# Altium project SiLPA_HE.PrjPCB (part 1 of 7)
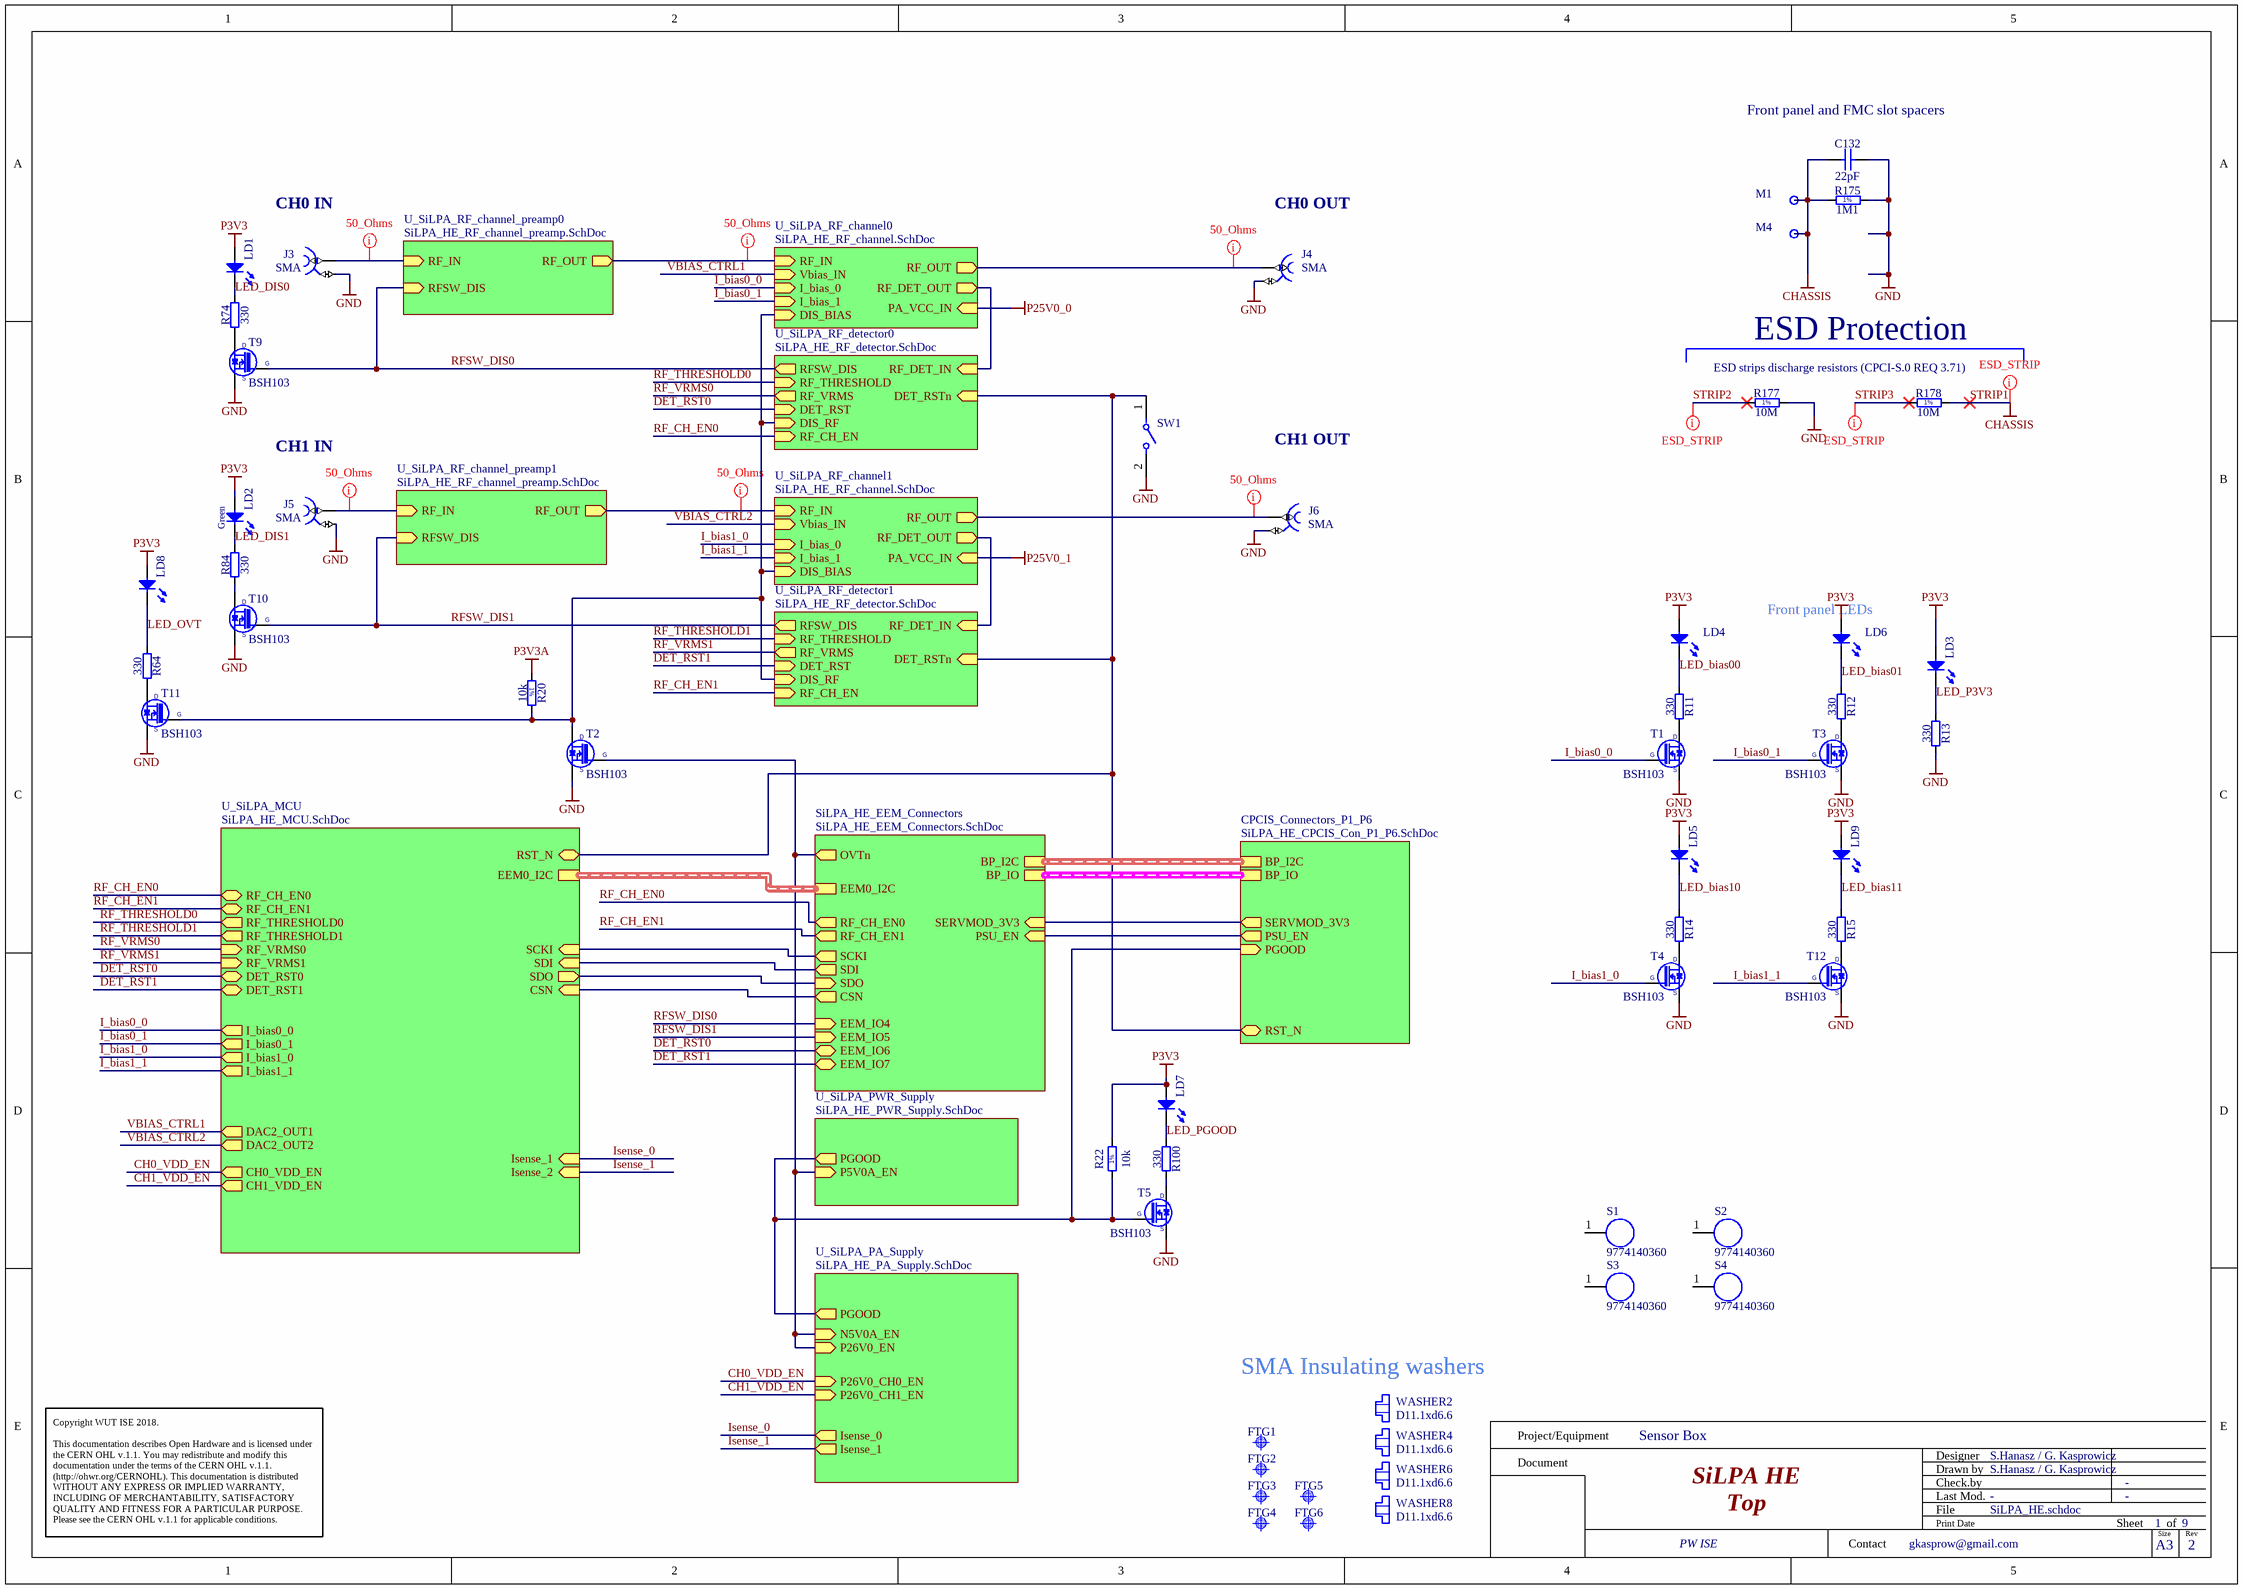
[diagram p0: SiLPA_HE.schdoc]
9 sheets, 662 parts. Net scope: hierarchical (ports join the sheet entries above them; power ports are global).
Board files: SiLPA_HE.PcbDoc, Panel_SiLPA.PcbDoc
Sheets:
  SiLPA_HE.schdoc
    SiLPA_HE_EEM_Connectors = SiLPA_HE_EEM_Connectors.SchDoc
    U_SiLPA_PWR_Supply = SiLPA_HE_PWR_Supply.SchDoc
    U_SiLPA_RF_channel0 = SiLPA_HE_RF_channel.SchDoc
    U_SiLPA_RF_channel_preamp0 = SiLPA_HE_RF_channel_preamp.SchDoc
    U_SiLPA_RF_detector0 = SiLPA_HE_RF_detector.SchDoc
    U_SiLPA_RF_channel_preamp1 = SiLPA_HE_RF_channel_preamp.SchDoc
    U_SiLPA_RF_detector1 = SiLPA_HE_RF_detector.SchDoc
    U_SiLPA_RF_channel1 = SiLPA_HE_RF_channel.SchDoc
    U_SiLPA_MCU = SiLPA_HE_MCU.SchDoc
    CPCIS_Connectors_P1_P6 = SiLPA_HE_CPCIS_Con_P1_P6.SchDoc
    U_SiLPA_PA_Supply = SiLPA_HE_PA_Supply.SchDoc

## Sheet SiLPA_HE.schdoc: SiLPA HE
size 420 x 297 mm; EDA_Number: ARTIQ; Projet: ARTIQ/SINARA; Author: S.Hanasz / G. Kasprowicz; CompanyName: WUT ISE; DrawnBy: S.Hanasz / G. Kasprowicz; Organization: WUT ISE; Address1: PW ISE; Address2: Nowowiejska 15/19 00-665 Warsaw; Address3: gkasprow@gmail.com; DocumentNumber: 1; Revision: 2; SheetNumber: 1; SheetTotal: 9; ModifiedBy: -; CheckedDate: -; Title2: Top; DivGrp: WUT ISE; Designer: S.Hanasz / G. Kasprowicz; ModifiedDate: -; ProjectName: Sensor Box

### Parts
C132  22pF  [CAPC1005X55N]
FTG1  Use only in PCB  [FIDUCIAL_TOP_C100-200]  (value not drawn)
FTG2  Use only in PCB  [FIDUCIAL_TOP_S100-200]  (value not drawn)
FTG3  Use only in PCB  [FIDUCIAL_TOP_S100-200]  (value not drawn)
FTG4  Use only in PCB  [FIDUCIAL_TOP_S100-200]  (value not drawn)
FTG5  Use only in PCB  [FIDUCIAL_TOP_S100-200]  (value not drawn)
FTG6  Use only in PCB  [FIDUCIAL_TOP_S100-200]  (value not drawn)
J3  SMA  [DELOCK_65848]
J4  SMA  [DELOCK_65848]
J5  SMA  [DELOCK_65848]
J6  SMA  [DELOCK_65848]
LD1  (no value)  [LED_AVAGO_HSMC-C120]
LD2  Green  [LED_AVAGO_HSME-C120]
LD3  (no value)  [LED_AVAGO_HSME-C120]
LD4  (no value)  [LED_AVAGO_HSME-C120]
LD5  (no value)  [LED_AVAGO_HSME-C120]
LD6  (no value)  [LED_AVAGO_HSME-C120]
LD7  (no value)  [LED_AVAGO_HSME-C120]
LD8  (no value)  [LED_AVAGO_HSMC-C120]
LD9  (no value)  [LED_AVAGO_HSME-C120]
M1  Plated Hole  [MTG300_600]  (value not drawn)  (no BOM)
M4  Plated Hole  [MTG300_600]  (value not drawn)  (no BOM)
R11  330  [RESC1005X40N]
R12  330  [RESC1005X40N]
R13  330  [RESC1005X40N]
R14  330  [RESC1005X40N]
R15  330  [RESC1005X40N]
R20  10k  [RESC1005X40N]
R22  10k  [RESC1005X40N]
R64  330  [RESC1005X40N]
R74  330  [RESC1005X40N]
R84  330  [RESC1005X40N]
R100  330  [RESC1005X40N]
R175  1M1  [RESC2012X60N]
R177  10M  [RESC2113X55N]
R178  10M  [RESC2113X55N]
S1  9774140360  [9774140360]
S2  9774140360  [9774140360]
S3  9774140360  [9774140360]
S4  9774140360  [9774140360]
SW1  (no value)  [FP-B3U-3000PM-MFG]
T1  BSH103  [SOT95P230X110-3N]
T2  BSH103  [SOT95P230X110-3N]
T3  BSH103  [SOT95P230X110-3N]
T4  BSH103  [SOT95P230X110-3N]
T5  BSH103  [SOT95P230X110-3N]
T9  BSH103  [SOT95P230X110-3N]
T10  BSH103  [SOT95P230X110-3N]
T11  BSH103  [SOT95P230X110-3N]
T12  BSH103  [SOT95P230X110-3N]
WASHER2  D11.1xd6.6  [Keystone_7687]
WASHER4  D11.1xd6.6  [Keystone_7687]
WASHER6  D11.1xd6.6  [Keystone_7687]
WASHER8  D11.1xd6.6  [Keystone_7687]

### Sub-sheets
CPCIS_Connectors_P1_P6 = SiLPA_HE_CPCIS_Con_P1_P6.SchDoc: BP_I2C (harness I2C), SERVMOD_3V3 (out), RST_N (bidir), BP_IO (harness EEM_LVDS), PSU_EN (out), PGOOD (in)
SiLPA_HE_EEM_Connectors = SiLPA_HE_EEM_Connectors.SchDoc: EEM_IO6 (bidir), SCKI (out), SDI (out), SDO (in), EEM_IO5 (in), CSN (out), EEM_IO4 (in), EEM_IO7 (bidir), OVTn (out), BP_IO (harness EEM_LVDS), BP_I2C (harness I2C), SERVMOD_3V3 (in), PSU_EN (in), RF_CH_EN1 (out), RF_CH_EN0 (out), EEM0_I2C (harness I2C)
U_SiLPA_MCU = SiLPA_HE_MCU.SchDoc: RF_THRESHOLD0 (out), RF_THRESHOLD1 (out), RF_VRMS0 (in), RF_VRMS1 (in), DET_RST0 (bidir), DET_RST1 (bidir), CSN (in), SDO (out), SDI (in), SCKI (in), RF_CH_EN0 (bidir), RF_CH_EN1 (bidir), I_bias0_0 (out), I_bias0_1 (out), I_bias1_0 (out), I_bias1_1 (out), RST_N (bidir), DAC2_OUT1 (out), DAC2_OUT2 (out), EEM0_I2C (harness I2C), CH1_VDD_EN (out), CH0_VDD_EN (out), Isense_1 (in), Isense_2 (in)
U_SiLPA_PA_Supply = SiLPA_HE_PA_Supply.SchDoc: PGOOD (out), N5V0A_EN (in), P26V0_EN (in), P26V0_CH1_EN (in), P26V0_CH0_EN (in), Isense_0 (out), Isense_1 (out)
U_SiLPA_PWR_Supply = SiLPA_HE_PWR_Supply.SchDoc: PGOOD (out), P5V0A_EN (in)
U_SiLPA_RF_channel0 = SiLPA_HE_RF_channel.SchDoc: RF_OUT (out), RF_IN (in), RF_DET_OUT (out), I_bias_1 (in), I_bias_0 (in), DIS_BIAS (in), PA_VCC_IN (in), Vbias_IN (in)
U_SiLPA_RF_channel1 = SiLPA_HE_RF_channel.SchDoc: RF_OUT (out), RF_IN (in), RF_DET_OUT (out), I_bias_1 (in), I_bias_0 (in), DIS_BIAS (in), PA_VCC_IN (in), Vbias_IN (in)
U_SiLPA_RF_channel_preamp0 = SiLPA_HE_RF_channel_preamp.SchDoc: RF_IN (in), RF_OUT (out), RFSW_DIS (in)
U_SiLPA_RF_channel_preamp1 = SiLPA_HE_RF_channel_preamp.SchDoc: RF_IN (in), RF_OUT (out), RFSW_DIS (in)
U_SiLPA_RF_detector0 = SiLPA_HE_RF_detector.SchDoc: RF_DET_IN (in), RFSW_DIS (out), RF_THRESHOLD (in), RF_VRMS (out), DET_RST (in), RF_CH_EN (in), DIS_RF (in), DET_RSTn (in)
U_SiLPA_RF_detector1 = SiLPA_HE_RF_detector.SchDoc: RF_DET_IN (in), RFSW_DIS (out), RF_THRESHOLD (in), RF_VRMS (out), DET_RST (in), RF_CH_EN (in), DET_RSTn (in), DIS_RF (in)

### Nets
GND: C132.2 J3.2 J4.2 J5.2 J6.2 R13.2 R175.2 R177.2 SW1.2 T1.2(S) T2.2(S) T3.2(S) T4.2(S) T5.2(S) T9.2(S) T10.2(S) T11.2(S) T12.2(S)
P3V3: LD1.2(A) LD2.2(A) LD3.2(A) LD4.2(A) LD5.2(A) LD6.2(A) LD7.2(A) LD8.2(A) LD9.2(A) R22.2
P3V3A: R20.1
STRIP1: C132.1 M1.1 M4.1 R175.1 R178.2  [also labelled CHASSIS]
CH0_VDD_EN: sheet U_SiLPA_MCU/CH0_VDD_EN, sheet U_SiLPA_PA_Supply/P26V0_CH0_EN
CH1_VDD_EN: sheet U_SiLPA_MCU/CH1_VDD_EN, sheet U_SiLPA_PA_Supply/P26V0_CH1_EN
DET_RST0: sheet SiLPA_HE_EEM_Connectors/EEM_IO6, sheet U_SiLPA_RF_detector0/DET_RST, sheet U_SiLPA_MCU/DET_RST0
DET_RST1: sheet SiLPA_HE_EEM_Connectors/EEM_IO7, sheet U_SiLPA_RF_detector1/DET_RST, sheet U_SiLPA_MCU/DET_RST1
I_bias0_0: T1.1(G) ; sheet U_SiLPA_RF_channel0/I_bias_0, sheet U_SiLPA_MCU/I_bias0_0
I_bias0_1: T3.1(G) ; sheet U_SiLPA_RF_channel0/I_bias_1, sheet U_SiLPA_MCU/I_bias0_1
I_bias1_0: T4.1(G) ; sheet U_SiLPA_RF_channel1/I_bias_0, sheet U_SiLPA_MCU/I_bias1_0
I_bias1_1: T12.1(G) ; sheet U_SiLPA_RF_channel1/I_bias_1, sheet U_SiLPA_MCU/I_bias1_1
Isense_0: sheet U_SiLPA_MCU/Isense_1, sheet U_SiLPA_PA_Supply/Isense_0
Isense_1: sheet U_SiLPA_MCU/Isense_2, sheet U_SiLPA_PA_Supply/Isense_1
LED_bias00: LD4.1(C) R11.1
LED_bias01: LD6.1(C) R12.1
LED_bias10: LD5.1(C) R14.1
LED_bias11: LD9.1(C) R15.1
LED_DIS0: LD1.1(C) R74.1
LED_DIS1: LD2.1(C) R84.1
LED_OVT: LD8.1(C) R64.1
LED_P3V3: LD3.1(C) R13.1
LED_PGOOD: LD7.1(C) R100.1
PGOOD: R22.1 T5.1(G) ; sheet U_SiLPA_PWR_Supply/PGOOD, sheet CPCIS_Connectors_P1_P6/PGOOD, sheet U_SiLPA_PA_Supply/PGOOD
RF_CH_EN0: sheet SiLPA_HE_EEM_Connectors/RF_CH_EN0, sheet U_SiLPA_RF_detector0/RF_CH_EN, sheet U_SiLPA_MCU/RF_CH_EN0  [project net ADC_IN2]
RF_CH_EN1: sheet SiLPA_HE_EEM_Connectors/RF_CH_EN1, sheet U_SiLPA_RF_detector1/RF_CH_EN, sheet U_SiLPA_MCU/RF_CH_EN1  [project net ADC_IN3]
RF_THRESHOLD0: sheet U_SiLPA_RF_detector0/RF_THRESHOLD, sheet U_SiLPA_MCU/RF_THRESHOLD0  [project net DAC_OUT1]
RF_THRESHOLD1: sheet U_SiLPA_RF_detector1/RF_THRESHOLD, sheet U_SiLPA_MCU/RF_THRESHOLD1  [project net DAC_OUT2]
RF_VRMS0: sheet U_SiLPA_RF_detector0/RF_VRMS, sheet U_SiLPA_MCU/RF_VRMS0  [project net ADC_IN0]
RF_VRMS1: sheet U_SiLPA_RF_detector1/RF_VRMS, sheet U_SiLPA_MCU/RF_VRMS1  [project net ADC_IN1]
RFSW_DIS0: T9.1(G) ; sheet SiLPA_HE_EEM_Connectors/EEM_IO4, sheet U_SiLPA_RF_channel_preamp0/RFSW_DIS, sheet U_SiLPA_RF_detector0/RFSW_DIS
RFSW_DIS1: T10.1(G) ; sheet SiLPA_HE_EEM_Connectors/EEM_IO5, sheet U_SiLPA_RF_channel_preamp1/RFSW_DIS, sheet U_SiLPA_RF_detector1/RFSW_DIS
RST_N: SW1.1 ; sheet U_SiLPA_RF_detector0/DET_RSTn, sheet U_SiLPA_RF_detector1/DET_RSTn, sheet U_SiLPA_MCU/RST_N, sheet CPCIS_Connectors_P1_P6/RST_N
SERVMOD_3V3: sheet SiLPA_HE_EEM_Connectors/SERVMOD_3V3, sheet CPCIS_Connectors_P1_P6/SERVMOD_3V3
SPI1_MISO: sheet SiLPA_HE_EEM_Connectors/SDO, sheet U_SiLPA_MCU/SDO
SPI1_MOSI: sheet SiLPA_HE_EEM_Connectors/SDI, sheet U_SiLPA_MCU/SDI
SPI1_NSS: sheet SiLPA_HE_EEM_Connectors/CSN, sheet U_SiLPA_MCU/CSN
SPI1_SCK: sheet SiLPA_HE_EEM_Connectors/SCKI, sheet U_SiLPA_MCU/SCKI
STRIP2: R177.1
STRIP3: R178.1
VBIAS_CTRL1: sheet U_SiLPA_RF_channel0/Vbias_IN, sheet U_SiLPA_MCU/DAC2_OUT1
VBIAS_CTRL2: sheet U_SiLPA_RF_channel1/Vbias_IN, sheet U_SiLPA_MCU/DAC2_OUT2
NetC11A_1: J3.1 ; sheet U_SiLPA_RF_channel_preamp0/RF_IN
NetC11B_1: J5.1 ; sheet U_SiLPA_RF_channel_preamp1/RF_IN
NetC16A_2: sheet U_SiLPA_RF_channel0/RF_IN, sheet U_SiLPA_RF_channel_preamp0/RF_OUT
NetC16B_2: sheet U_SiLPA_RF_channel_preamp1/RF_OUT, sheet U_SiLPA_RF_channel1/RF_IN
NetC44A_2: J4.1 ; sheet U_SiLPA_RF_channel0/RF_OUT
NetC44B_2: J6.1 ; sheet U_SiLPA_RF_channel1/RF_OUT
NetC52A_1: sheet U_SiLPA_RF_channel0/RF_DET_OUT, sheet U_SiLPA_RF_detector0/RF_DET_IN
NetC52B_1: sheet U_SiLPA_RF_detector1/RF_DET_IN, sheet U_SiLPA_RF_channel1/RF_DET_OUT
NetIC24A_1: R20.2 T2.3(D) T11.1(G) ; sheet U_SiLPA_RF_channel0/DIS_BIAS, sheet U_SiLPA_RF_detector0/DIS_RF, sheet U_SiLPA_RF_detector1/DIS_RF, sheet U_SiLPA_RF_channel1/DIS_BIAS
NetIC26_3: T2.1(G) ; sheet SiLPA_HE_EEM_Connectors/OVTn, sheet U_SiLPA_PWR_Supply/P5V0A_EN, sheet U_SiLPA_PA_Supply/N5V0A_EN, sheet U_SiLPA_PA_Supply/P26V0_EN
NetR11_2: R11.2 T1.3(D)
NetR12_2: R12.2 T3.3(D)
NetR14_2: R14.2 T4.3(D)
NetR15_2: R15.2 T12.3(D)
NetR64_2: R64.2 T11.3(D)
NetR74_2: R74.2 T9.3(D)
NetR84_2: R84.2 T10.3(D)
NetR100_2: R100.2 T5.3(D)
NetR114_1: sheet SiLPA_HE_EEM_Connectors/PSU_EN, sheet CPCIS_Connectors_P1_P6/PSU_EN

Not connected (* = marked no-connect by the designer): S1 1; S2 1; S3 1; S4 1

### Buses and harness runs
harness sheet CPCIS_Connectors_P1_P6/BP_I2C = sheet SiLPA_HE_EEM_Connectors/BP_I2C
harness sheet CPCIS_Connectors_P1_P6/BP_IO = sheet SiLPA_HE_EEM_Connectors/BP_IO
harness sheet SiLPA_HE_EEM_Connectors/EEM0_I2C = sheet U_SiLPA_MCU/EEM0_I2C

### Layout directives
net class 50_Ohms: NetC11A_1, NetC11B_1, NetC16A_2, NetC16B_2, NetC44A_2, NetC44B_2
net class ESD_STRIP: STRIP1, STRIP2, STRIP3

### Notes on the sheet
- (near C132) Front panel and FMC slot spacers
- CH0 IN
- CH0 OUT
- ESD strips discharge resistors (CPCI-S.0 REQ 3.71)
- ESD Protection
- CH1 IN
- CH1 OUT
- (near LD6) Front panel LEDs
- (near WASHER2) SMA Insulating washers
- Project/Equipment
- Document
- Designer
- Drawn by
- Check.by
- Copyright WUT ISE 2018.
  This documentation describes Open Hardware and is licensed under the CERN OHL v.1.1. You may redistribute and modify this documentation under the terms of the CERN OHL v.1.1. (http://ohwr.org/CERNOHL). This documentation is distributed WITHOUT ANY EXPRESS OR IMPLIED WARRANTY, INCLUDING OF MERCHANTABILITY, SATISFACTORY QUALITY AND FITNESS FOR A PARTICULAR PURPOSE. Please see the CERN OHL v.1.1 for applicable conditions.
- Contact
- File
- Last Mod.
- Print Date
- Sheet
- Size
- A3
- of
- Rev
- (in symbol R0402_10K_1%_0.0625W_100PPM) 1%
- (in symbol R0402_10k_1%_0.0625W_100PPM) 1%
- (in symbol R0805_1M1_1%_0.125W_100PPM) 1%
- (in symbol R0805_10M_1%_0.125W_100PPM_VISHAY_CRCW e3) 1%

### Library data of the parts
C132 = CC0402_22PF_50V_5%_C0G: Non-polarised capacitor; Part Description: SMD Multilayer Chip Ceramic Capacitor; Manufacturer: GENERIC; Manufacturer1 Part Number: C0402C220J5GACTU; Voltage: 50V; TC: C0G/NP0; Tolerance: ±5%; Part Number: CC0402_22PF_50V_5%_C0G; Component Kind: Standard; Component Type: Standard; Pin Count: 2; Value: 22pF; Status: Preferred; Manufacturer Part Number: CC0402_22PF_50V_5%_C0G; Case: 0402; Mounted: Yes; Socket: No; SMD: Yes; Manufacturer1 Example: KEMET; Manufacturer1 ComponentHeight: 0.55mm; HelpURL: \\cern.ch\dfs\Applications\Altium\Datasheets\CC0402_C0G_KEMET_(Commercial Grade).pdf; Author: CERN DEM JLC; CreateDate: 03.12.2007; LatestRevisionDate: 03.12.2007; Sense: No
FTG1 = FIDUCIAL_TARGET_C100-200: Fiducial Target; Part Description: Round Fiducial Target, Top Layer, 1.0mm, Top Solder 2.0mm, Keepout =2.0mm; Mounted: No; Part Number: FIDUCIAL_TARGET_C100-200; Component Kind: Standard (No BOM); Component Type: Standard (No BOM); Pin Count: 1; Family: Fiducial; Socket: No; SMD: Yes; Sense: No; Status: None; ComponentHeight: 0mm; HelpURL: Undefined; Author: CERN DEM JLC; CreateDate: 09.02.2010; LatestRevisionDate: 04.04.2012; PackageDescription: Round Fiducial Target, Top Layer, 1.0mm, Top Solder 2.0mm, Keepout =2.0mm
FTG2-FTG6 = FIDUCIAL_TARGET_S100-200: Fiducial Target; Part Description: Square Fiducial Target, Top Layer, 1.0mm, Top Solder 2.0mm, Keepout =2.0mm; Mounted: No; Part Number: FIDUCIAL_TARGET_S100-200; Component Kind: Standard (No BOM); Component Type: Standard (No BOM); Pin Count: 1; Family: Fiducial; Socket: No; SMD: Yes; Sense: No; Status: None; ComponentHeight: 0mm; HelpURL: Undefined; Author: CERN DEM JLC; CreateDate: 09.02.2010; LatestRevisionDate: 04.04.2012; PackageDescription: Square Fiducial Target, Top Layer, 1.0mm, Top Solder 2.0mm, Keepout =2.0mm
J3-J6 = DELOCK_65848: 50 Ohm Through Hole SMA Right Angle PCB Jack; Manufacturer: DELOCK; Manufacturer Part Number: 5848 (4043619658480); PressFit: No; Part Number: DELOCK_65848; Component Kind: Standard; Component Type: Standard; Pin Count: 5; Family: SMA; Mounted: Yes; Socket: No; SMD: No; Sense: No; Status: None; Part Description: 50 Ohm Through Hole SMA Right Angle PCB Jack; ComponentHeight: 12.5; HelpURL: \\cern.ch\dfs\Applications\Altium\Datasheets\AMPHENOL_132203-16.pdf; Author: GK; CreateDate: 13.05.2019; LatestRevisionDate: 13.05.2019
LD1 LD8 = LED_AVAGO_HSMC-C120: LED Red 1C 2A; Part Description: High Performance Right Angle Chip Red LED; Manufacturer: AVAGO TECHNOLOGIES; PressFit: No; Bonding: No; Part Number: LED_AVAGO_HSMC-C120; Component Kind: Standard; Component Type: Standard; Color: Red; PackageDescription: Red Chip LED, 2-Leads, Body 1.7x1.1mm, Side Emitting Package; Manufacturer Part Number: HSMC-C120; Pin Count: 2; Mounted: Yes; Socket: No; SMD: Yes; Sense: No; ComponentHeight: 0.7mm; HelpURL: \\cern.ch\dfs\Applications\Altium\Datasheets\LED_AVAGO_HSMC-C120.pdf; ComponentLink1URL: \\cern.ch\dfs\Applications\Altium\Datasheets\LED_AVAGO_HSMC-C120_DESIGN-GUIDE.pdf; ComponentLink1Description: Design Guide; Author: CERN DEM JMW; CreateDate: 22.07.2009; LatestRevisionDate: 20.06.2012
LD2-LD7 LD9 = LED_AVAGO_HSME-C120: LED Green 1C 2A; Part Description: High Performance Right Angle Chip Green LED; Manufacturer: AVAGO TECHNOLOGIES; PressFit: No; Bonding: No; Part Number: LED_AVAGO_HSME-C120; Component Kind: Standard; Component Type: Standard; Color: Green; PackageDescription: Green Chip LED, 2-Leads, Body 1.7x1.1mm, Side Emitting Package; Manufacturer Part Number: HSME-C120; Pin Count: 2; Mounted: Yes; Socket: No; SMD: Yes; Sense: No; ComponentHeight: 0.7mm; HelpURL: \\cern.ch\dfs\Applications\Altium\Datasheets\LED_AVAGO_HSME-C120.pdf; ComponentLink1URL: \\cern.ch\dfs\Applications\Altium\Datasheets\LED_AVAGO_HSME-C110_DESIGN-GUIDE.pdf; ComponentLink1Description: Design Guide; Author: CERN DEM JMW; CreateDate: 22.07.2009; LatestRevisionDate: 20.06.2012
M1 M4 = PLATED_HOLE3.0_PAD6.0: Single Terminal Socket; Part Description: Plated Through Hole: Hole Dia.=3.0mm Pad Dia.=6.0mm; Mounted: No; Table: Pads; Part Number: PLATED_HOLE3.0_PAD6.0; Component Type: Standard (No BOM); Designator: Single Terminal Socket; Library Reference: Single Terminal Socket; Pin Count: 1; Family: Plated Hole; Socket: No; SMD: No; Status: None; ComponentHeight: 0mm; Author: CERN DEM JLC; CreateDate: 26.05.2008; LatestRevisionDate: 26.05.2008; PackageDescription: Plated Through Hole: Hole Dia.=3.0mm Pad Dia.=6.0mm
R11-R15 R64 R74 R84 R100 = R0402_330R_1%_0.0625W_100PPM: Resistor - 1%; Part Description: General Purpose Thick Film Chip Resistor; Manufacturer: GENERIC; Manufacturer1 Part Number: 232270673301L; TC: ±100ppm/°C; PressFit: No; Part Number: R0402_330R_1%_0.0625W_100PPM; Component Kind: Standard; Component Type: Standard; Pin Count: 2; Value: 330; Status: Not Recommended; Power: 0.0625W; Tolerance: ±1%; Manufacturer Part Number: R0402_330R_1%_0.0625W_100PPM; Case: 0402; Mounted: Yes; Sense: No; Socket: No; SMD: Yes; Manufacturer1 Example: YAGEO PHYCOMP; Manufacturer1 ComponentHeight: 0.4mm; HelpURL: \\cern.ch\dfs\Applications\Altium\Datasheets\R0402_Phycomp_RC0402.pdf; Author: CERN DEM JLC; CreateDate: 03.12.2007; LatestRevisionDate: 17.10.2012
R20 = R0402_10K_1%_0.0625W_100PPM: Resistor - 1%; Part Description: General Purpose Thick Film Chip Resistor; Manufacturer: GENERIC; Manufacturer1 Part Number: 232270671003L; TC: ±100ppm/°C; Table: Resistors SMD; Part Number: R0402_10K_1%_0.0625W_100PPM; Component Kind: Standard; Component Type: Standard; Pin Count: 2; Value: 10k; Status: Not recommended; Power: 0.0625W; Tolerance: ±1%; Manufacturer Part Number: R0402_10K_1%_0.0625W_100PPM; Case: 0402; Mounted: Yes; Socket: No; SMD: Yes; Manufacturer1 Example: YAGEO PHYCOMP; Manufacturer1 ComponentHeight: 0.4mm; HelpURL: \\cern.ch\dfs\Applications\Altium\Datasheets\R0402_Phycomp_RC0402.pdf; Author: CERN DEM JLC; CreateDate: 2007-12-03; LatestRevisionDate: 2012-10-17
R22 = R0402_10k_1%_0.0625W_100PPM: Resistor - 1%; Part Description: General Purpose Thick Film Chip Resistor; Manufacturer: GENERIC; Manufacturer1 Part Number: 232270671003L; TC: ±100ppm/°C; PressFit: No; Part Number: R0402_10K_1%_0.0625W_100PPM; Component Kind: Standard; Component Type: Standard; Pin Count: 2; Value: 10k; Status: Not Recommended; Power: 0.0625W; Tolerance: ±1%; Manufacturer Part Number: R0402_10K_1%_0.0625W_100PPM; Case: 0402; Mounted: Yes; Sense: No; Socket: No; SMD: Yes; Manufacturer1 Example: YAGEO PHYCOMP; Manufacturer1 ComponentHeight: 0.4mm; HelpURL: \\cern.ch\dfs\Applications\Altium\Datasheets\R0402_Phycomp_RC0402.pdf; Author: CERN DEM JLC; CreateDate: 03.12.2007; LatestRevisionDate: 17.10.2012
R175 = R0805_1M1_1%_0.125W_100PPM: Resistor - 1%; Part Description: General Purpose Thick Film Chip Resistor; Manufacturer: GENERIC; Manufacturer1 Part Number: NRC10F1104TRF; Power: 0.125W; TC: ±100ppm/°C; PressFit: No; Part Number: R0805_1M1_1%_0.125W_100PPM; Component Kind: Standard; Component Type: Standard; Pin Count: 2; Value: 1M1; Status: Preferred; Tolerance: ±1%; Manufacturer Part Number: R0805_1M1_1%_0.125W_100PPM; Case: 0805; Mounted: Yes; Sense: No; Socket: No; SMD: Yes; Manufacturer1 Example: NIC COMPONENT; Manufacturer1 ComponentHeight: 0.6mm; HelpURL: \\cern.ch\dfs\Applications\Altium\Datasheets\R0805_NIC_NRC.pdf; Author: CERN DEM JLC; CreateDate: 03/12/2007; LatestRevisionDate: 13/03/2008
R177 R178 = R0805_10M_1%_0.125W_100PPM_VISHAY_CRCW e3: Resistor - 1%; Part Description: 150V, Standard Thick Film Chip Resistor; Manufacturer: VISHAY DALE; Manufacturer Part Number: CRCW080510M0FKEA; Power: 0.125W; TC: ±100ppm/°C; PressFit: No; Part Number: R0805_10M_1%_0.125W_100PPM_VISHAY_CRCW e3; Component Kind: Standard; Component Type: Standard; Pin Count: 2; Value: 10M; Status: None; Tolerance: ±1%; Case: 0805; Mounted: Yes; Sense: No; Socket: No; SMD: Yes; ComponentHeight: 0.5mm; HelpURL: \\cern.ch\dfs\Applications\Altium\Datasheets\R0805_VISHAY_CRCW e3.pdf; Author: CERN DEM BC; CreateDate: 2019-11-12; LatestRevisionDate: 2019-11-12
S1-S4 = WA-SMSI,  9774140360: WA-SMSI SMD Steel Spacer with internal Thread; Manufacturer: Wurth Elektronik; partNo: 9774140360; ComponentLink1Description: Manufacturer; ComponentLink1URL: http://www.we-online.de; Created by: Baojun Chen; Created Date: 20.Oct.2015; ComponentLink2Description: Datasheet; ComponentLink2URL: http://katalog.we-online.de/em/datasheet/9774140360.pdf
SW1 = CMP-08834-000057-1: SWITCH TACTILE SPST-NO 0.05A 12V; Connector Type: SMD/SMT; Switch Travel: 0.2mm; Throw Configuration: SPST; Illumination Type: Non-Illuminated; Mechanical Life: 100000Cycles; Actuator Length: 0.7mm; Switch Function: Off-Mom; Ratings: Dust Proof; Operating Force: 1.59N; Max Current Rating: 50mA; Contact Resistance: 100mR; Termination: Gull Wing; Packaging: Tape and Reel; Case/Package: SMD/SMT; Orientation: Right Angle; Package Quantity: 1000; Mount: Surface Mount; Series: B3U; Max Voltage Rating (DC): 12V; Depth: 3.2mm; Max Operating Temperature: 70°C; RoHS Compliant: Yes; Weight: 0.022g; Min Operating Temperature: -25°C; Electrical Life: 100000Cycles; Current Rating: 50mA; Length: 4mm; Voltage Rating (DC): 12V
T1-T5 T9-T12 = BSH103: N-CHANNEL MOSFET WITH DIODE; Part Description: 30V, 850mA N-Channel Enhancement Mode Field-Effect Transistor; Manufacturer: NEXPERIA; PressFit: No; Bonding: No; Part Number: BSH103; Component Kind: Standard; Component Type: Standard; Device: BSH103; PackageDescription: SOT23, 0.95mm Pitch; 3 Pin, 1.30mm W X 2.90mm L X 1.10mm H body, IPC Medium Density; Manufacturer Part Number: BSH103; Pin Count: 3; Case: SOT23-3; Mounted: Yes; Socket: No; SMD: Yes; Sense: No; ComponentHeight: 1.1mm; HelpURL: \\cern.ch\dfs\Applications\Altium\Datasheets\BSH103.pdf; Author: CERN DEM JLC; CreateDate: 16.03.2010; LatestRevisionDate: 20.06.2017
WASHER2 WASHER4 WASHER6 WASHER8 = Keystone_7687: SMA_Shoulder Washer; Part Number: custom 3D; Part Description: Polyphenylene Sulfide PPS Shoulder Washer; PressFit: No; Component Kind: Standard; Component Type: Mechanical; Footprint: custom 3D; Pin Count: 0; PackageDescription: Polyphenylene Sulfide PPS Shoulder Washer; Mounted: Yes; Socket: No; SMD: No; Sense: No; Status: None; Value: D11.1xd6.6; Manufacturer: custom 3D; Manufacturer Part Number: custom 3D; ComponentHeight: 1.91mm; HelpURL: \\cern.ch\dfs\Applications\Altium\Datasheets\AAVID-THERMALLOY_7721-7PPSG.pdf; Author: GK; CreateDate: 28.01.2016; LatestRevisionDate: 28.01.2016

## Sheet SiLPA_HE_EEM_Connectors.SchDoc: SiLPA HE
size 420 x 297 mm; EDA_Number: ARTIQ; Projet: ARTIQ/SINARA; Author: G.Kasprowicz; CompanyName: WUT ISE; DrawnBy: G.Kasprowicz; Organization: WUT ISE; Address1: PW ISE; Address2: Nowowiejska 15/19 00-665 Warsaw; Address3: gkasprow@gmail.com; DocumentNumber: 9; Revision: 1; SheetNumber: 9; SheetTotal: 9; ModifiedBy: -; CheckedDate: -; Title2: EEM connectors; DivGrp: WUT ISE; Designer: G.Kasprowicz; SPICEModelCache: <root> / <DocumentId>MJNKMGWL</DocumentId> / </root>; ModifiedDate: -; ProjectName: Sensor Box
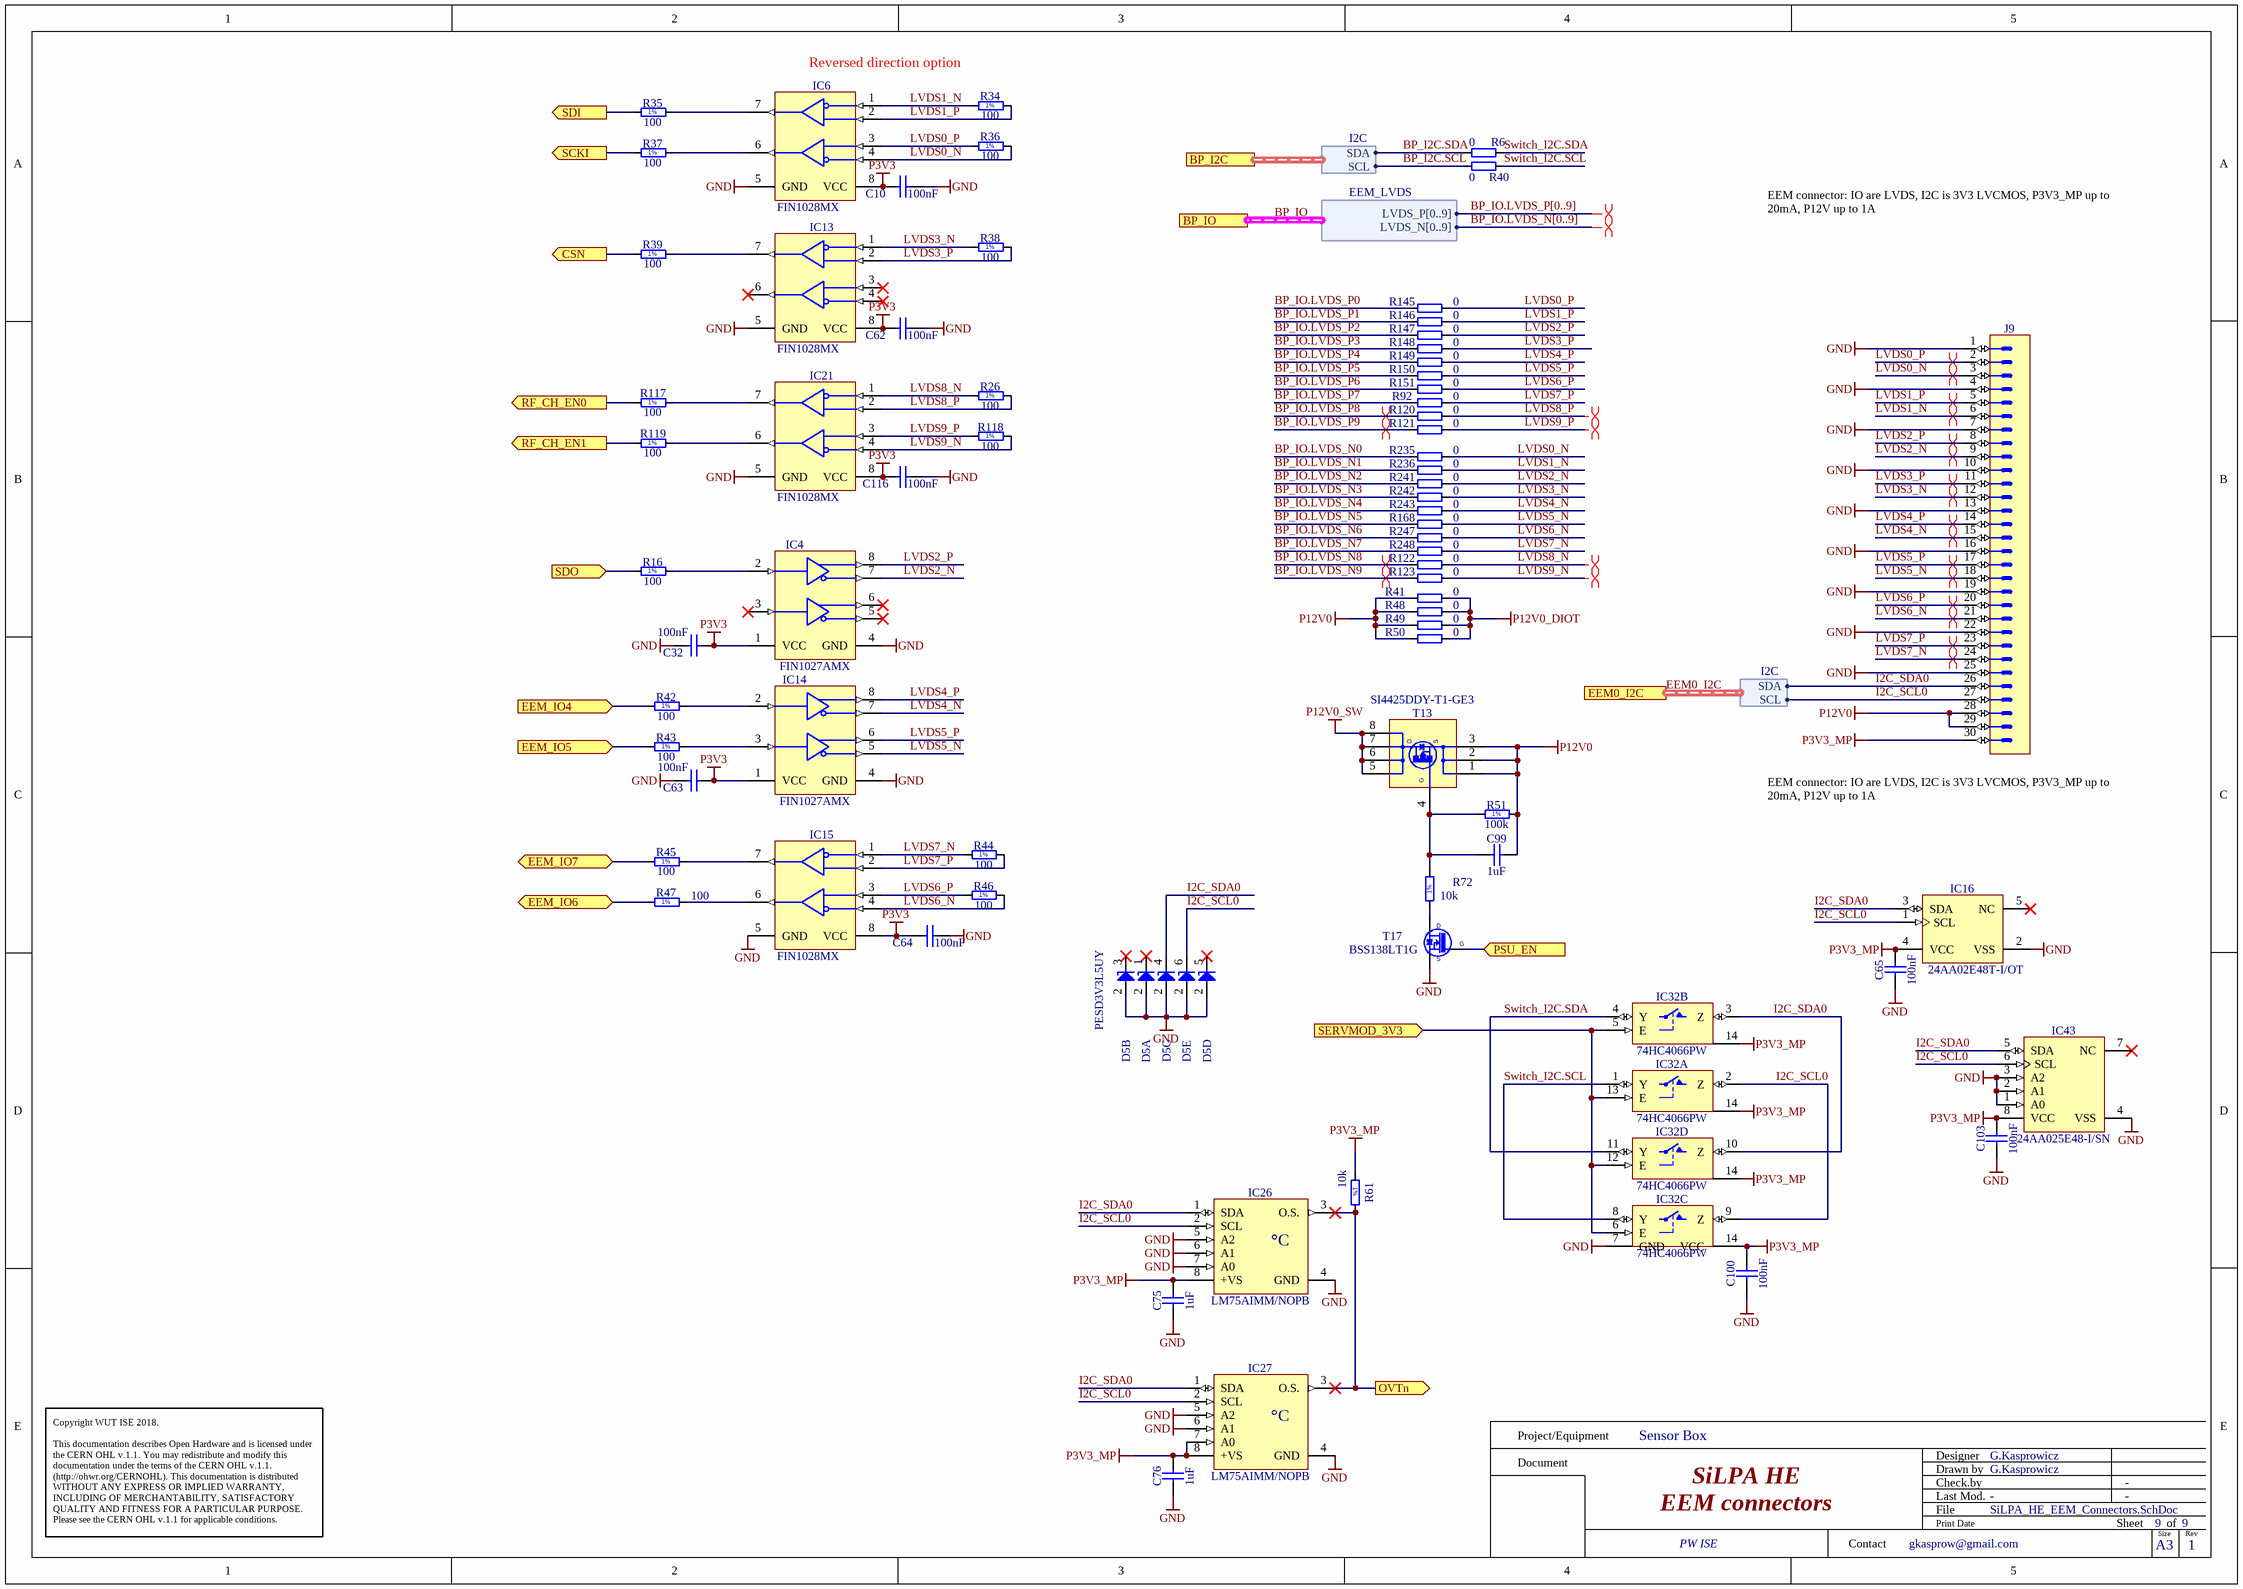
[diagram p1: SiLPA_HE_EEM_Connectors.SchDoc]

### Parts
C10  100nF  [CAPC1005X55N]
C32  100nF  [CAPC1005X55N]
C62  100nF  [CAPC1005X55N]
C63  100nF  [CAPC1005X55N]
C64  100nF  [CAPC1005X55N]
C65  100nF  [CAPC1005X55N]
C75  1uF  [CAPC1005X55N]
C76  1uF  [CAPC1005X55N]
C99  1uF  [CAPC1005X55N]
C100  100nF  [CAPC1005X55N]
C103  100nF  [CAPC1005X55N]
C116  100nF  [CAPC1005X55N]
D5  PESD3V3L5UY  [SOT65P210X110-6N]  (value not drawn)  (parts A,B,C,D,E of 5)
IC4  FIN1027AMX  [SOIC127P600X175-8N]
IC6  FIN1028MX  [SOIC127P600X175-8N]
IC13  FIN1028MX  [SOIC127P600X175-8N]
IC14  FIN1027AMX  [SOIC127P600X175-8N]
IC15  FIN1028MX  [SOIC127P600X175-8N]
IC16  24AA02E48T-I/OT  [SOT95P280X145-5N]
IC21  FIN1028MX  [SOIC127P600X175-8N]
IC26  LM75AIMM/NOPB  [SOP65P490X109-8N]
IC27  LM75AIMM/NOPB  [SOP65P490X109-8N]
IC32  74HC4066PW  [SOP65P640X110-14N]  (parts A,B,C,D of 4)
IC43  24AA025E48-I/SN  [SOIC127P600X175-8N]
J9  (no value)  [3M_N2530-6002RB]
R6  0  [RESC1005X40N]
R16  100  [RESC1005X40N]
R26  100  [RESC1005X40N]
R34  100  [RESC1005X40N]
R35  100  [RESC1005X40N]
R36  100  [RESC1005X40N]
R37  100  [RESC1005X40N]
R38  100  [RESC1005X40N]
R39  100  [RESC1005X40N]
R40  0  [RESC1005X40N]
R41  0  [RESC1005X40N]
R42  100  [RESC1005X40N]
R43  100  [RESC1005X40N]
R44  100  [RESC1005X40N]
R45  100  [RESC1005X40N]
R46  100  [RESC1005X40N]
R47  100  [RESC1005X40N]
R48  0  [RESC1005X40N]
R49  0  [RESC1005X40N]
R50  0  [RESC1005X40N]
R51  100k  [RESC1608X55N]
R61  10k  [RESC1005X40N]
R72  10k  [RESC1005X40N]
R92  0  [RESC1005X40N]
R117  100  [RESC1005X40N]
R118  100  [RESC1005X40N]
R119  100  [RESC1005X40N]
R120  0  [RESC1005X40N]
R121  0  [RESC1005X40N]
R122  0  [RESC1005X40N]
R123  0  [RESC1005X40N]
R145  0  [RESC1005X40N]
R146  0  [RESC1005X40N]
R147  0  [RESC1005X40N]
R148  0  [RESC1005X40N]
R149  0  [RESC1005X40N]
R150  0  [RESC1005X40N]
R151  0  [RESC1005X40N]
R168  0  [RESC1005X40N]
R235  0  [RESC1005X40N]
R236  0  [RESC1005X40N]
R241  0  [RESC1005X40N]
R242  0  [RESC1005X40N]
R243  0  [RESC1005X40N]
R247  0  [RESC1005X40N]
R248  0  [RESC1005X40N]
T13  SI4425DDY-T1-GE3  [SOIC127P600X175-8N]
T17  BSS138LT1G  [SOT95P240X110-3N]

### Ports
BP_I2C (harness I2C), BP_IO (harness EEM_LVDS), CSN (out), EEM0_I2C (harness I2C), EEM_IO4 (in), EEM_IO5 (in), EEM_IO6 (bidir), EEM_IO7 (bidir), OVTn (out), PSU_EN (in), RF_CH_EN0 (out), RF_CH_EN1 (out), SCKI (out), SDI (out), SDO (in), SERVMOD_3V3 (in)

### Harnesses
EEM_LVDS: LVDS_P[0..9], LVDS_N[0..9]
I2C: SDA, SCL

### Nets
GND: C10.1 C32.1 C62.1 C63.1 C64.1 C65.1 C75.1 C76.1 C100.1 C103.1 C116.1 D5.2(A) IC4.4(GND) IC6.5(GND) IC13.5(GND) IC14.4(GND) IC15.5(GND) IC16.2(VSS) IC21.5(GND) IC26.4(GND) IC26.5(A2) IC26.6(A1) IC26.7(A0) IC27.4(GND) IC27.5(A2) IC27.6(A1) IC32.7(GND) IC43.1(A0) IC43.2(A1) IC43.3(A2) IC43.4(VSS) J9.1 J9.4 J9.7 J9.10 J9.13 J9.16 J9.19 J9.22 J9.25 T17.2(S)
P3V3: C10.2 C32.2 C62.2 C63.2 C64.2 C116.2 IC4.1(VCC) IC6.8(VCC) IC13.8(VCC) IC14.1(VCC) IC15.8(VCC) IC21.8(VCC)
P3V3_MP: C65.2 C75.2 C76.2 C100.2 C103.2 IC16.4(VCC) IC26.8(+VS) IC27.7(A0) IC27.8(+VS) IC32.14(VCC) IC43.8(VCC) J9.30 R61.1
P12V0: C99.2 J9.28 J9.29 R41.1 R48.1 R49.1 R50.1 R51.2 T13.1(S) T13.2(S) T13.3(S)
P12V0_DIOT: R41.2 R48.2 R49.2 R50.2
P12V0_SW: T13.5(D) T13.6(D) T13.7(D) T13.8(D)
ADC_IN2: R117.1 ; port RF_CH_EN0
ADC_IN3: R119.1 ; port RF_CH_EN1
BP_I2C.SCL: R40.1 ; port BP_I2C.SCL
BP_I2C.SDA: R6.1 ; port BP_I2C.SDA
BP_IO.LVDS_N0: R235.1
BP_IO.LVDS_N1: R236.1
BP_IO.LVDS_N2: R241.1
BP_IO.LVDS_N3: R242.1
BP_IO.LVDS_N4: R243.1
BP_IO.LVDS_N5: R168.1
BP_IO.LVDS_N6: R247.1
BP_IO.LVDS_N7: R248.1
BP_IO.LVDS_N8: R122.1
BP_IO.LVDS_N9: R123.1
BP_IO.LVDS_P0: R145.1
BP_IO.LVDS_P1: R146.1
BP_IO.LVDS_P2: R147.1
BP_IO.LVDS_P3: R148.1
BP_IO.LVDS_P4: R149.1
BP_IO.LVDS_P5: R150.1
BP_IO.LVDS_P6: R151.1
BP_IO.LVDS_P7: R92.1
BP_IO.LVDS_P8: R120.1
BP_IO.LVDS_P9: R121.1
DET_RST0: R47.1 ; port EEM_IO6
DET_RST1: R45.1 ; port EEM_IO7
I2C_SCL0: D5.6(C) IC16.1(SCL) IC26.2(SCL) IC27.2(SCL) IC32.2(Z) IC32.9(Z) IC43.6(SCL) J9.27 ; port EEM0_I2C.SCL  [project net EEM0_I2C.SCL]
I2C_SDA0: D5.4(C) IC16.3(SDA) IC26.1(SDA) IC27.1(SDA) IC32.3(Z) IC32.10(Z) IC43.5(SDA) J9.26 ; port EEM0_I2C.SDA  [project net EEM0_I2C.SDA]
LVDS0_N: IC6.4(RIN2-) J9.3 R36.2 R235.2
LVDS0_P: IC6.3(RIN2+) J9.2 R36.1 R145.2
LVDS1_N: IC6.1(RIN1-) J9.6 R34.1 R236.2
LVDS1_P: IC6.2(RIN1+) J9.5 R34.2 R146.2
LVDS2_N: IC4.7(DOUT-) J9.9 R241.2
LVDS2_P: IC4.8(DOUT+) J9.8 R147.2
LVDS3_N: IC13.1(RIN1-) J9.12 R38.1 R242.2
LVDS3_P: IC13.2(RIN1+) J9.11 R38.2 R148.2
LVDS4_N: IC14.7(DOUT-) J9.15 R243.2
LVDS4_P: IC14.8(DOUT+) J9.14 R149.2
LVDS5_N: IC14.5(DOUT-) J9.18 R168.2
LVDS5_P: IC14.6(DOUT+) J9.17 R150.2
LVDS6_N: IC15.4(RIN2-) J9.21 R46.2 R247.2
LVDS6_P: IC15.3(RIN2+) J9.20 R46.1 R151.2
LVDS7_N: IC15.1(RIN1-) J9.24 R44.1 R248.2
LVDS7_P: IC15.2(RIN1+) J9.23 R44.2 R92.2
LVDS8_N: IC21.1(RIN1-) R26.1 R122.2
LVDS8_P: IC21.2(RIN1+) R26.2 R120.2
LVDS9_N: IC21.4(RIN2-) R118.2 R123.2
LVDS9_P: IC21.3(RIN2+) R118.1 R121.2
RFSW_DIS0: R42.1 ; port EEM_IO4
RFSW_DIS1: R43.1 ; port EEM_IO5
SERVMOD_3V3: IC32.5(E) IC32.6(E) IC32.12(E) IC32.13(E) ; port SERVMOD_3V3
SPI1_MISO: R16.1 ; port SDO
SPI1_MOSI: R35.1 ; port SDI
SPI1_NSS: R39.1 ; port CSN
SPI1_SCK: R37.1 ; port SCKI
Switch_I2C.SCL: IC32.1(Y) IC32.8(Y) R40.2
Switch_I2C.SDA: IC32.4(Y) IC32.11(Y) R6.2
NetC99_1: C99.1 R51.1 R72.2 T13.4(S)
NetIC4_2: IC4.2(DIN1) R16.2
NetIC6_6: IC6.6(ROUT2) R37.2
NetIC6_7: IC6.7(ROUT1) R35.2
NetIC13_7: IC13.7(ROUT1) R39.2
NetIC14_2: IC14.2(DIN1) R42.2
NetIC14_3: IC14.3(DIN2RIN-) R43.2
NetIC15_6: IC15.6(ROUT2) R47.2
NetIC15_7: IC15.7(ROUT1) R45.2
NetIC21_6: IC21.6(ROUT2) R119.2
NetIC21_7: IC21.7(ROUT1) R117.2
NetIC26_3: IC26.3(O.S.) IC27.3(O.S.) R61.2 ; port OVTn
NetR72_1: R72.1 T17.3(D)
NetR114_1: T17.1(G) ; port PSU_EN

Not connected (* = marked no-connect by the designer): D5 1(C)* 3(C)* 5(C)*; IC4 3(DIN2RIN-)* 5(DOUT-)* 6(DOUT+)*; IC13 3(RIN2+)* 4(RIN2-)* 6(ROUT2)*; IC16 5(NC)*; IC43 7(NC)*

### Buses and harness runs
bus BP_IO.LVDS_N[0..9]
bus BP_IO.LVDS_P[0..9]
harness BP_IO = port BP_IO
harness EEM0_I2C = port EEM0_I2C

### Layout directives
differential pair; differential pair class EEM0; net class EEM0: BP_IO.LVDS_N8, BP_IO.LVDS_N9, BP_IO.LVDS_P8, BP_IO.LVDS_P9, LVDS0_N, LVDS0_P, LVDS1_N, LVDS1_P, LVDS2_N, LVDS2_P, LVDS3_N, LVDS3_P, LVDS4_N, LVDS4_P, LVDS5_N, LVDS5_P, LVDS6_N, LVDS6_P, LVDS7_N, LVDS7_P, LVDS8_N, LVDS8_P, LVDS9_N, LVDS9_P
differential pair: (no net found under the mark)

### Notes on the sheet
- Reversed direction option
- EEM connector: IO are LVDS, I2C is 3V3 LVCMOS, P3V3_MP up to 20mA, P12V up to 1A
- (near J9) EEM connector: IO are LVDS, I2C is 3V3 LVCMOS, P3V3_MP up to 20mA, P12V up to 1A
- Project/Equipment
- Document
- Designer
- Drawn by
- Check.by
- Copyright WUT ISE 2018.
  This documentation describes Open Hardware and is licensed under the CERN OHL v.1.1. You may redistribute and modify this documentation under the terms of the CERN OHL v.1.1. (http://ohwr.org/CERNOHL). This documentation is distributed WITHOUT ANY EXPRESS OR IMPLIED WARRANTY, INCLUDING OF MERCHANTABILITY, SATISFACTORY QUALITY AND FITNESS FOR A PARTICULAR PURPOSE. Please see the CERN OHL v.1.1 for applicable conditions.
- Contact
- File
- Last Mod.
- Print Date
- Sheet
- Size
- A3
- of
- Rev
- (in symbol LM75AIMM/NOPB) °C
- (in symbol R0402_10K_1%_0.0625W_100PPM) 1%
- (in symbol R0402_100R_1%_0.0625W_100PPM) 1%
- (in symbol R0603_100K_1%_0.1W_100PPM) 1%
- (in symbol SI4425DDY-T1-GE3) G

### Library data of the parts
C10 C32 C62-C65 C100 C116 = CC0402_100NF_16V_10%_X5R: Non-polarised capacitor; Part Description: SMD Multilayer Chip Ceramic Capacitor; Manufacturer: GENERIC; Manufacturer1 Part Number: GRM155R61C104KA88D; Voltage: 16V; TC: X5R; Tolerance: ±10%; Part Number: CC0402_100NF_16V_10%_X5R; Component Kind: Standard; Component Type: Standard; Pin Count: 2; Value: 100nF; Status: None; Manufacturer Part Number: CC0402_100NF_16V_10%_X5R; Case: 0402; Mounted: Yes; Socket: No; SMD: Yes; Sense: No; Manufacturer1 Example: MURATA; Manufacturer1 ComponentHeight: 0.55mm; HelpURL: \\cern.ch\dfs\Applications\Altium\Datasheets\CC0402_X5R_MURATA_GRM.pdf; Author: CERN DEM JLC; CreateDate: 10.12.2013; LatestRevisionDate: 10.12.2013
C75 C76 C99 = CC0402_1UF_16V_10%_X5R: Non-polarised capacitor; Part Description: SMD Multilayer Chip Ceramic Capacitor; Manufacturer: GENERIC; Manufacturer1 Part Number: C1005X5R1C105KT; Voltage: 16V; TC: X5R; Tolerance: ±10%; Part Number: CC0402_1UF_16V_10%_X5R; Component Kind: Standard; Component Type: Standard; Pin Count: 2; Value: 1uF; Status: Preferred; Manufacturer Part Number: CC0402_1UF_16V_10%_X5R; Case: 0402; Mounted: Yes; Socket: No; SMD: Yes; Sense: No; Manufacturer1 Example: TDK; Manufacturer1 ComponentHeight: 0.55mm; HelpURL: \\cern.ch\dfs\Applications\Altium\Datasheets\CC0402_X5R_TDK_C.pdf; Author: CERN DEM JLC
  C75 C76: CreateDate: 25.10.2012; LatestRevisionDate: 25.10.2012
  C99: CreateDate: 2012-10-25; LatestRevisionDate: 2012-10-25
C103 = CC0402_100NF_50V_10%_X7R: Non-polarised capacitor; Part Description: SMD Multilayer Chip Ceramic Capacitor; Manufacturer: GENERIC; Manufacturer1 Part Number: GRM155R71H104KE14D; Voltage: 50V; TC: X7R; Tolerance: ±10%; Part Number: CC0402_100NF_50V_10%_X7R; Component Kind: Standard; Component Type: Standard; Pin Count: 2; Value: 100nF; Status: None; Manufacturer Part Number: CC0402_100NF_50V_10%_X7R; Case: 0402; Mounted: Yes; Socket: No; SMD: Yes; Sense: No; Manufacturer1 Example: MURATA; Manufacturer1 ComponentHeight: 0.55mm; HelpURL: \\cern.ch\dfs\Applications\Altium\Datasheets\CC0402_MURATA_GRM155R71H104KE14D.pdf; Author: CERN DEM MR; CreateDate: 30.06.2017; LatestRevisionDate: 30.06.2017
D5 = PESD3V3L5UY: Fivefold ESD Protection Diode Arrays; Part Description: Fivefold ESD Protection Diode Arrays (30kV); Manufacturer: NEXPERIA; Voltage: 3.3V; Power: 200W; PressFit: No; Bonding: No; Part Number: PESD3V3L5UY; Component Kind: Standard; Component Type: Standard; Device: PESD3V3L5UY; PackageDescription: SOT363, SC-88, 0.65mm Pitch; 6 Pin, 1.25mm W X 2.00mm L X 1.10mm H body, IPC Medium Density; Manufacturer Part Number: PESD3V3L5UY; Pin Count: 6; Case: SOT363; Mounted: Yes; Socket: No; SMD: Yes; Sense: No; ComponentHeight: 1.1mm; HelpURL: \\cern.ch\dfs\Applications\Altium\Datasheets\PESD3V3L5UY.pdf; Author: CERN DEM WB; CreateDate: 05.07.2021; LatestRevisionDate: 05.07.2021
IC4 IC14 = IFC_FIN1027A: 3.3V LVDS, 2-Bit, High-Speed, Differential Driver; Manufacturer: ON Semiconductor; PressFit: No; Bonding: No; Part Number: FIN1027AMX; Component Kind: Standard; Component Type: Standard; Device: FIN1027AMX; PackageDescription: SOIC 8, Pitch 1.27mm - Body 4x5mm, IPC Medium Density; Part Description: 3.3V LVDS, 2-Bit, High-Speed, Differential Driver; Manufacturer Part Number: FIN1027AMX; Pin Count: 8; Case: SOIC8; Mounted: Yes; Socket: No; SMD: Yes; Sense: No; ComponentHeight: 0.8mm; Author: GK; HelpURL: \\cern.ch\dfs\Applications\Altium\Datasheets\FIN1101K8X.pdf; CreateDate: 08/11/2016; LatestRevisionDate: 08/11/2016
IC6 IC13 IC15 IC21 = IFC_FIN1028: 3.3V LVDS 2-Bit High-Speed Differential Reciever; Manufacturer: ON Semiconductor; PressFit: No; Bonding: No; Part Number: FIN1028MX; Component Kind: Standard; Component Type: Standard; Device: FIN1028MX; PackageDescription: SOIC 8, Pitch 1.27mm - Body 4x5mm, IPC Medium Density; Part Description: 3.3V LVDS 2-Bit High-Speed Differential Reciever; Manufacturer Part Number: FIN1028MX; Pin Count: 8; Case: SOIC8; Mounted: Yes; Socket: No; SMD: Yes; Sense: No; ComponentHeight: 0.8mm; Author: GK; HelpURL: \\cern.ch\dfs\Applications\Altium\Datasheets\FIN1101K8X.pdf; CreateDate: 08/11/2016; LatestRevisionDate: 08/11/2016
IC16 = 24AA02E48T-I/OT: 1.7V-5.5V, 2K I2C Serial EEPROM With EUI-48 Node Identity; Manufacturer: MICROCHIP TECHNOLOGY; PressFit: No; Bonding: No; Part Number: 24AA02E48T-I/OT; Component Kind: Standard; Component Type: Standard; Device: 24AA02E48T-I/OT; PackageDescription: SOT, 0.95mm pitch; 5 pin, 1.60mm W X 2.90mm L X 1.45mm H body, IPC Medium Density; Part Description: 1.7V-5.5V, 2K I2C Serial EEPROM With EUI-48 Node Identity; Manufacturer Part Number: 24AA02E48T-I/OT; Pin Count: 5; Case: SOT23-5; Mounted: Yes; Socket: No; SMD: Yes; Sense: No; ComponentHeight: 1.45mm; HelpURL: \\cern.ch\dfs\Applications\Altium\Datasheets\24AA02E48T-I-OT.pdf; Author: CERN DEM MR; CreateDate: 31.03.2016; LatestRevisionDate: 31.03.2016
IC26 IC27 = LM75AIMM/NOPB: Digital Temperature Sensor and Thermal Watchdog with Two-Wire Interface; Part Description: -25° to +100°C ±2°C Digital Temperature Sensor and Thermal Watchdog with Two-Wire Interface; Manufacturer: TEXAS INSTRUMENTS; PressFit: No; Bonding: No; Part Number: LM75AIMM/NOPB; Component Kind: Standard; Component Type: Standard; Device: LM75AIMM/NOPB; PackageDescription: SOP, 0.65mm pitch; 8 pin,3.00mm W X 3.00mm L X 1.09mm H bodyI, PC Medium Density; Manufacturer Part Number: LM75AIMM/NOPB; Pin Count: 8; Case: SSOP8; Mounted: Yes; Socket: No; SMD: Yes; Sense: No; ComponentHeight: 1.09mm; HelpURL: \\cern.ch\dfs\Applications\Altium\Datasheets\LM75AIMM-NOPB.pdf; Author: CERN DEM JLC; CreateDate: 15.10.2012; LatestRevisionDate: 15.10.2012
IC32 = 74HC4066PW: Part Description: Quad Single-Pole Single-Throw Analog Switch; Manufacturer: NXP SEMICONDUCTORS; PressFit: No; Bonding: No; Table: Standard Logic; Part Number: 74HC4066PW; Component Kind: Standard; Component Type: Standard; Device: 74HC4066PW; PackageDescription: SOP, 14-Leads, Body 4.4x5mm (max), Pitch 0.65mm, IPC Medium Density; Manufacturer Part Number: 74HC4066PW; Pin Count: 14; Case: TSSOP14; Mounted: Yes; Socket: No; SMD: Yes; ComponentHeight: 1.1mm; Author: CERN DEM JLC; HelpURL: \\cern.ch\dfs\Applications\Altium\Datasheets\74HC4066PW.pdf; CreateDate: 2014-11-19; LatestRevisionDate: 2014-11-19
IC43 = 24AA025E48-I/SN: 1.7V-5.5V, 2K I2C™ Serial EEPROMs with EUI-48™ Node Identity; Manufacturer: MICROCHIP TECHNOLOGY; PressFit: No; Bonding: No; Part Number: 24AA025E48-I/SN; Component Kind: Standard; Component Type: Standard; Device: 24AA025E48-I/SN; PackageDescription: SOIC 8, Pitch 1.27mm - Body 4x5mm, IPC Medium Density; Part Description: 1.7V-5.5V, 2K I2C™ Serial EEPROMs with EUI-48™ Node Identity; Manufacturer Part Number: 24AA025E48-I/SN; Pin Count: 8; Case: SOIC8; Mounted: Yes; Socket: No; SMD: Yes; Sense: No; ComponentHeight: 1.75mm; HelpURL: \\cern.ch\dfs\Applications\Altium\Datasheets\24AA025E48-I-SN.pdf; Author: CERN DEM MR; CreateDate: 19.07.2016; LatestRevisionDate: 19.07.2016
J9 = 3M_N2530-6002RB: Connector 30 Male; Part Description: 30 Contacts - Straight .100'' x .100'' Low Profile Four-Wall Header, 2500 Series; Manufacturer: 3M; PressFit: No; Part Number: 3M_N2530-6002RB; Component Kind: Standard; Component Type: Standard; Pin Count: 30; Family: Header 30; Mounted: Yes; Socket: No; SMD: No; Sense: No; Status: None; Manufacturer Part Number: N2530-6002RB; ComponentHeight: 10.03mm; HelpURL: \\cern.ch\dfs\Applications\Altium\Datasheets\3M_N2530-6002RB.pdf; Author: CERN DEM JLC; CreateDate: 11.02.2009; LatestRevisionDate: 11.08.2009
R6 R40 R41 R48-R50 R92 R120-R123 R145-R151 R168 R235 R236 R241-R243 R247 R248 = R0402_0R_JUMPER: Resistor; Part Description: 1A (0.05R Max DC Resistance) Zero Ohm Jumper; Manufacturer: GENERIC; Manufacturer1 Part Number: 232270591001L; PressFit: No; Part Number: R0402_0R_JUMPER; Component Kind: Standard; Component Type: Standard; Pin Count: 2; Value: 0; Status: Not Recommended; Manufacturer Part Number: R0402_0R_JUMPER; Case: 0402; Mounted: Yes; Sense: No; Socket: No; SMD: Yes; Manufacturer1 Example: YAGEO PHYCOMP; Manufacturer1 ComponentHeight: 0.4mm; HelpURL: \\cern.ch\dfs\Applications\Altium\Datasheets\R0402_Phycomp_RC0402.pdf; Author: CERN DEM JLC; CreateDate: 03.12.2007; LatestRevisionDate: 17.10.2012
R16 R26 R34-R39 R42-R47 R117-R119 = R0402_100R_1%_0.0625W_100PPM: Resistor - 1%; Part Description: General Purpose Thick Film Chip Resistor; Manufacturer: GENERIC; Manufacturer1 Part Number: 232270671001L; TC: ±100ppm/°C; PressFit: No; Part Number: R0402_100R_1%_0.0625W_100PPM; Component Kind: Standard; Component Type: Standard; Pin Count: 2; Value: 100; Status: Not Recommended; Power: 0.0625W; Tolerance: ±1%; Manufacturer Part Number: R0402_100R_1%_0.0625W_100PPM; Case: 0402; Mounted: Yes; Sense: No; Socket: No; SMD: Yes; Manufacturer1 Example: YAGEO PHYCOMP; Manufacturer1 ComponentHeight: 0.4mm; HelpURL: \\cern.ch\dfs\Applications\Altium\Datasheets\R0402_Phycomp_RC0402.pdf; Author: CERN DEM JLC; CreateDate: 03.12.2007; LatestRevisionDate: 17.10.2012
R51 = R0603_100K_1%_0.1W_100PPM: Resistor - 1%; Part Description: General Purpose Thick Film Chip Resistor; Manufacturer: GENERIC; Manufacturer1 Part Number: NRC06F1003TRF; Power: 0.1W; TC: ±100ppm/°C; Part Number: R0603_100K_1%_0.1W_100PPM; Component Kind: Standard; Component Type: Standard; Pin Count: 2; Value: 100k; Status: Preferred; Tolerance: ±1%; Manufacturer Part Number: R0603_100K_1%_0.1W_100PPM; Case: 0603; Mounted: Yes; Sense: No; Socket: No; SMD: Yes; Manufacturer1 Example: NIC COMPONENT; Manufacturer1 ComponentHeight: 0.55mm; HelpURL: \\cern.ch\dfs\Applications\Altium\Datasheets\R0603_NIC_NRC.pdf; Author: CERN DEM JLC; CreateDate: 2007-12-03; LatestRevisionDate: 2008-03-13
R61 = R0402_10K_1%_0.0625W_100PPM: as R20 on sheet SiLPA_HE; Part Number: R0402_10K_1%_0.0625W_100PPM; Component Kind: Standard; Component Type: Standard; Pin Count: 2; Value: 10k; Status: Not recommended; Power: 0.0625W; Tolerance: ±1%; Manufacturer Part Number: R0402_10K_1%_0.0625W_100PPM; Case: 0402; Mounted: Yes; Socket: No; SMD: Yes; Manufacturer1 Example: YAGEO PHYCOMP; Manufacturer1 ComponentHeight: 0.4mm; HelpURL: \\cern.ch\dfs\Applications\Altium\Datasheets\R0402_Phycomp_RC0402.pdf; Author: CERN DEM JLC; CreateDate: 2007-12-03; LatestRevisionDate: 2012-10-17
R72 = R0402_10K_1%_0.0625W_100PPM: Resistor - 1%; Part Description: General Purpose Thick Film Chip Resistor; Manufacturer: GENERIC; Manufacturer1 Part Number: 232270671003L; TC: ±100ppm/°C; Part Number: R0402_10K_1%_0.0625W_100PPM; Component Kind: Standard; Component Type: Standard; Pin Count: 2; Value: 10k; Status: Not recommended; Power: 0.0625W; Tolerance: ±1%; Manufacturer Part Number: R0402_10K_1%_0.0625W_100PPM; Case: 0402; Mounted: Yes; Sense: No; Socket: No; SMD: Yes; Manufacturer1 Example: YAGEO PHYCOMP; Manufacturer1 ComponentHeight: 0.4mm; HelpURL: \\cern.ch\dfs\Applications\Altium\Datasheets\R0402_Phycomp_RC0402.pdf; Author: CERN DEM JLC; CreateDate: 2007-12-03; LatestRevisionDate: 2012-10-17
T13 = SI4425DDY-T1-GE3: -30V -19.7A P-Channel MOSFET; Manufacturer: VISHAY SILICONIX; PressFit: No; Bonding: No; Part Number: SI4425DDY-T1-GE3; Component Kind: Standard; Component Type: Standard; Device: SI4425DDY-T1-GE3; PackageDescription: SOIC 8, Pitch 1.27mm - Body 4x5mm, IPC Medium Density; Part Description: -30V -19.7A P-Channel MOSFET; Manufacturer Part Number: SI4425DDY-T1-GE3; Pin Count: 8; Case: SOIC8; Mounted: Yes; Socket: No; SMD: Yes; Sense: No; ComponentHeight: 1.75mm; HelpURL: \\cern.ch\dfs\Applications\Altium\Datasheets\SI4425DDY-T1-GE3.pdf; Author: CERN DEM MR; CreateDate: 05/10/2016; LatestRevisionDate: 05/10/2016
T17 = BSS138LT1G: N-CHANNEL MOSFET WITH DIODE; Part Description: 50V 200mA N-Channel Enhancement Mode Field-Effect Transistor; Manufacturer: ON SEMICONDUCTOR; PressFit: No; Bonding: No; Part Number: BSS138LT1G; Component Kind: Standard; Component Type: Standard; Device: BSS138LT1G; PackageDescription: SOT23 3-Leads, Pitch 0.95mm - Body 1.4x3mm, IPC Medium Density; Manufacturer Part Number: BSS138LT1G; Pin Count: 3; Case: SOT23-3; Mounted: Yes; Socket: No; SMD: Yes; Sense: No; ComponentHeight: 1.11mm; HelpURL: \\cern.ch\dfs\Applications\Altium\Datasheets\BSS138LT1G.pdf; Author: CERN DEM JLC; CreateDate: 23.03.2009; LatestRevisionDate: 23.03.2009